# Altium schematic sheet WIFI.SchDoc
size A2
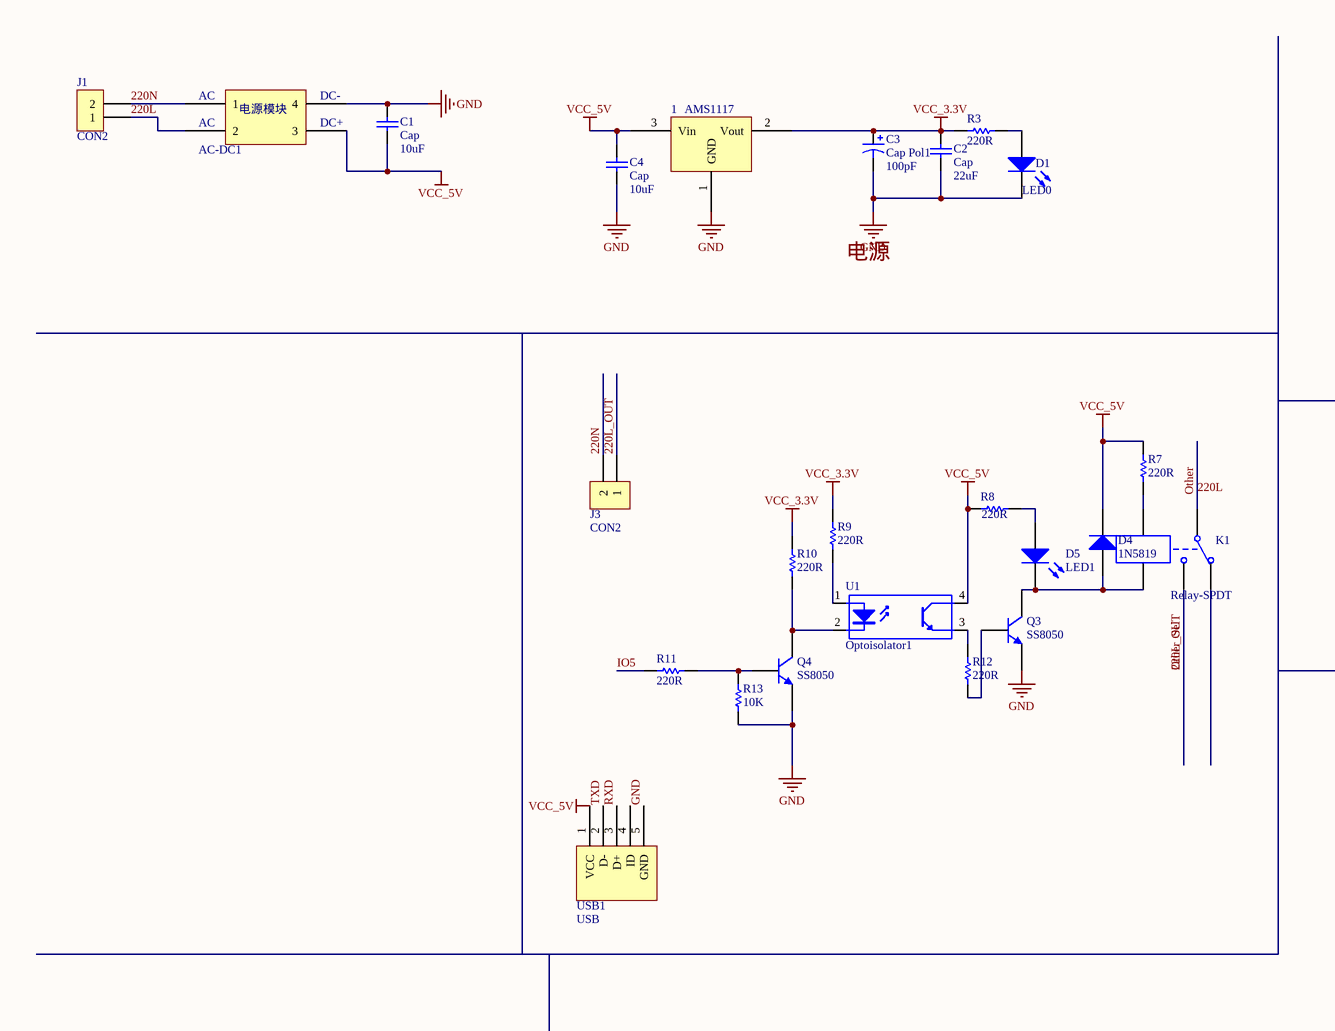
[diagram p0: WIFI.SchDoc, left]
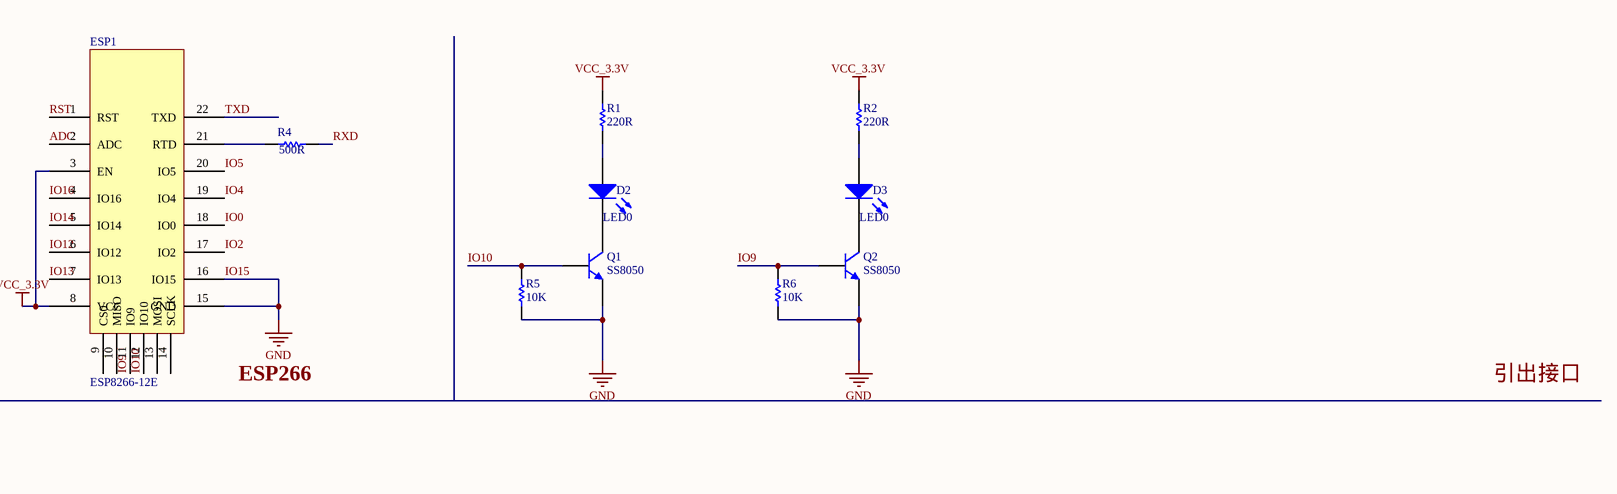
[diagram p1: WIFI.SchDoc, right]

## Parts
1  AMS1117  [SOT223]
AC-DC1  220—5  [POWER-220_5]  (value not drawn)
C1  Cap  value 10uF  [CAP-E SMD 8X8]
C2  Cap  value 22uF  [1206]
C3  Cap Pol1  value 100pF  [CAP-E SMD 8X8]
C4  Cap  value 10uF  [1206]
D1  LED0  [LED0805]
D2  LED0  [LED0805]
D3  LED0  [LED0805]
D4  1N5819  [DO-214AC/SMA]
D5  LED1  [LED0805]
ESP1  ESP8266-12E  [ESP8266]
J1  CON2  [TML-2-5.08]
J3  CON2  [TML-2-5.08]
K1  Relay-SPDT  [5V-5]
Q1  SS8050  [SOT-23]
Q2  SS8050  [SOT-23]
Q3  SS8050  [SOT-23]
Q4  SS8050  [SOT-23]
R1  value 220R  [0805]  (hidden comment: Res)
R2  value 220R  [0805]  (hidden comment: Res)
R3  value 220R  [0805]  (hidden comment: Res)
R4  value 500R  [0805]  (hidden comment: Res)
R5  value 10K  [0805]  (hidden comment: Res)
R6  value 10K  [0805]  (hidden comment: Res)
R7  value 220R  [0805]  (hidden comment: Res)
R8  value 220R  [0805]  (hidden comment: Res)
R9  value 220R  [0805]  (hidden comment: Res)
R10  value 220R  [0805]  (hidden comment: Res)
R11  value 220R  [0805]  (hidden comment: Res)
R12  value 220R  [0805]  (hidden comment: Res)
R13  value 10K  [0805]  (hidden comment: Res)
U1  Optoisolator1  [DIP4]
USB1  USB  [USB-MINI]

## Nets
GND: 1.1(GND) AC-DC1.4 C1.1 C2.2 C3.2 C4.2 D1.2(K) ESP1.15(GND) ESP1.16(IO15) Q1.1(E) Q2.1(E) Q3.1(E) Q4.1(E) R5.1 R6.1 R13.1 USB1.5(GND)  [also labelled IO15]
VCC_3.3V: 1.2(Vout) C2.1 C3.1 ESP1.3(EN) ESP1.8(VCC) R1.1 R2.1 R3.2 R9.2 R10.2
VCC_5V: 1.3(Vin) AC-DC1.3 C1.2 C4.1 D4.2(K) R7.2 R8.1 U1.4(C) USB1.1(VCC)
220L: AC-DC1.2 J1.1 K1.1  [also labelled Other]
220L_OUT: J3.1 K1.3  [also labelled Other_Sel]
220N: AC-DC1.1 J1.2 J3.2
ADC: ESP1.2(ADC)
IO0: ESP1.18(IO0)
IO2: ESP1.17(IO2)
IO4: ESP1.19(IO4)
IO5: ESP1.20(IO5) R11.2
IO9: ESP1.11(IO9) Q2.2(B) R6.2
IO10: ESP1.12(IO10) Q1.2(B) R5.2
IO12: ESP1.6(IO12)
IO13: ESP1.7(IO13)
IO14: ESP1.5(IO14)
IO16: ESP1.4(IO16)
RST: ESP1.1(RST)
RXD: R4.2 USB1.3(D+)
TXD: ESP1.22(TXD) USB1.2(D-)
NetD1_1: D1.1(A) R3.1
NetD2_1: D2.1(A) R1.2
NetD2_2: D2.2(K) Q1.3(C)
NetD3_1: D3.1(A) R2.2
NetD3_2: D3.2(K) Q2.3(C)
NetD4_1: D4.1(A) D5.2(K) K1.5 Q3.3(C)
NetD5_1: D5.1(A) R8.2
NetESP1_21: ESP1.21(RTD) R4.1
NetK1_4: K1.4 R7.1
NetQ3_2: Q3.2(B) R12.1
NetQ4_2: Q4.2(B) R11.1 R13.2
NetQ4_3: Q4.3(C) R10.1 U1.2(K)
NetR9_1: R9.1 U1.1(A)
NetR12_2: R12.2 U1.3(E)

Not connected (* = marked no-connect by the designer): ESP1 9(CS0) 10(MISO) 13(MOSI) 14(SCLK); K1 2; USB1 4(ID)

## Notes on the sheet
- Labels drawn without touching a wire or pin: ESP266, 引出接口, 电源
- (in symbol 220—5) AC; DC-; 电源模块; DC+

## Library data of the parts
AC-DC1 = 220—5: pin to pad: 1>2 2>1
C1 C2 C4 = Cap: Capacitor; Published: 8-Jun-2000; LatestRevisionDate: 17-Jul-2002; LatestRevisionNote: Re-released for DXP Platform.; PackageReference: RAD-0.3; Publisher: Altium Limited
C3 = Cap Pol1: Polarized Capacitor (Radial); Published: 8-Jun-2000; LatestRevisionDate: 17-Jul-2002; LatestRevisionNote: Re-released for DXP Platform.; PackageReference: RB7.6-15; Publisher: Altium Limited; PackageDescription: Polarized Capacitor (Radial); 2 Leads
D1-D3 = LED0: Typical INFRARED GaAs LED; Published: 8-Jun-2000; LatestRevisionDate: 08-Jul-2005; LatestRevisionNote: Mech Layer 1 removed.; PackageReference: LED-0; Publisher: Altium Limited; PackageDescription: LED; 2 Leads
D4 = Diode: Default Diode; Published: 8-Jun-2000; LatestRevisionDate: 17-Jul-2002; LatestRevisionNote: Re-released for DXP Platform.; PackageVersion: Sep-1996; PackageReference: SMC; Publisher: Altium Limited; Code_JEDEC: DO-214-AB; PackageDescription: DO-214-AB/SMC; 2 C-Bend Leads; Body 7.9 x 5.9 mm, inc. leads (LxW)
D5 = LED1: Typical RED GaAs LED; Published: 8-Jun-2000; LatestRevisionDate: 08-Jul-2005; LatestRevisionNote: Mech Layer 1 removed.; PackageReference: LED-1; Publisher: Altium Limited; PackageDescription: LED; 2 Leads
ESP1 = ESP8266
J1 = CON2: Connector; pin to pad: 1>2 2>1
J3 = CON2: Connector
K1 = Relay-SPDT: Single-Pole Dual-Throw Relay; pin to pad: 2>4 3>5 4>3 5>2; Published: 24-Mar-1999; LatestRevisionDate: 17-Jul-2002; LatestRevisionNote: Re-released for DXP Platform.; PackageReference: MODULE5B; Publisher: Altium Limited
Q1-Q4 = 2N3904: NPN General Purpose Amplifier; pin to pad: 1>2 2>1; Published: 8-Jun-2000; LatestRevisionDate: 15-Jan-2003; LatestRevisionNote: PCB Footprint 'BCY-W3/D4.7' replaced; DatasheetVersion: 1997; PackageVersion: Sep-1998; PackageReference: TO-92A; Publisher: Altium Limited; ComponentLink1Description: Manufacturer Link; ComponentLink1URL: http://www.fairchildsemi.com/; ComponentLink2Description: Datasheet; ComponentLink2URL: http://www.fairchildsemi.com/ds/2N%2F2N3904.pdf; PackageDescription: TO, Flat Index; 3 In-Line, Axial Leads; Body Dia. 4.5mm; Leads 0.51 x 0.48 mm (max)
R1-R13 = Res: Resistor; Published: 8-Jun-2000; LatestRevisionDate: 17-Jul-2002; LatestRevisionNote: Re-released for DXP Platform.; PackageReference: AXIAL-0.3; Publisher: Altium Limited; PackageDescription: Axial Device, Thru-Hole; 2 Leads; 0.3 in Pin Spacing
U1 = Optoisolator1: 4-Pin Phototransistor Optocoupler; Published: 24-Mar-1999; LatestRevisionDate: 04-Mar-2005; LatestRevisionNote: Sch pins 3 & 4 Swapped.; DatasheetVersion: Nov-2003; PackageReference: DIP-4; Publisher: Altium Limited
USB1 = miniUSB-b